# Altium schematic sheet ATWINC3400.SchDoc
size C; SheetNumber: 6; SheetTotal: 9
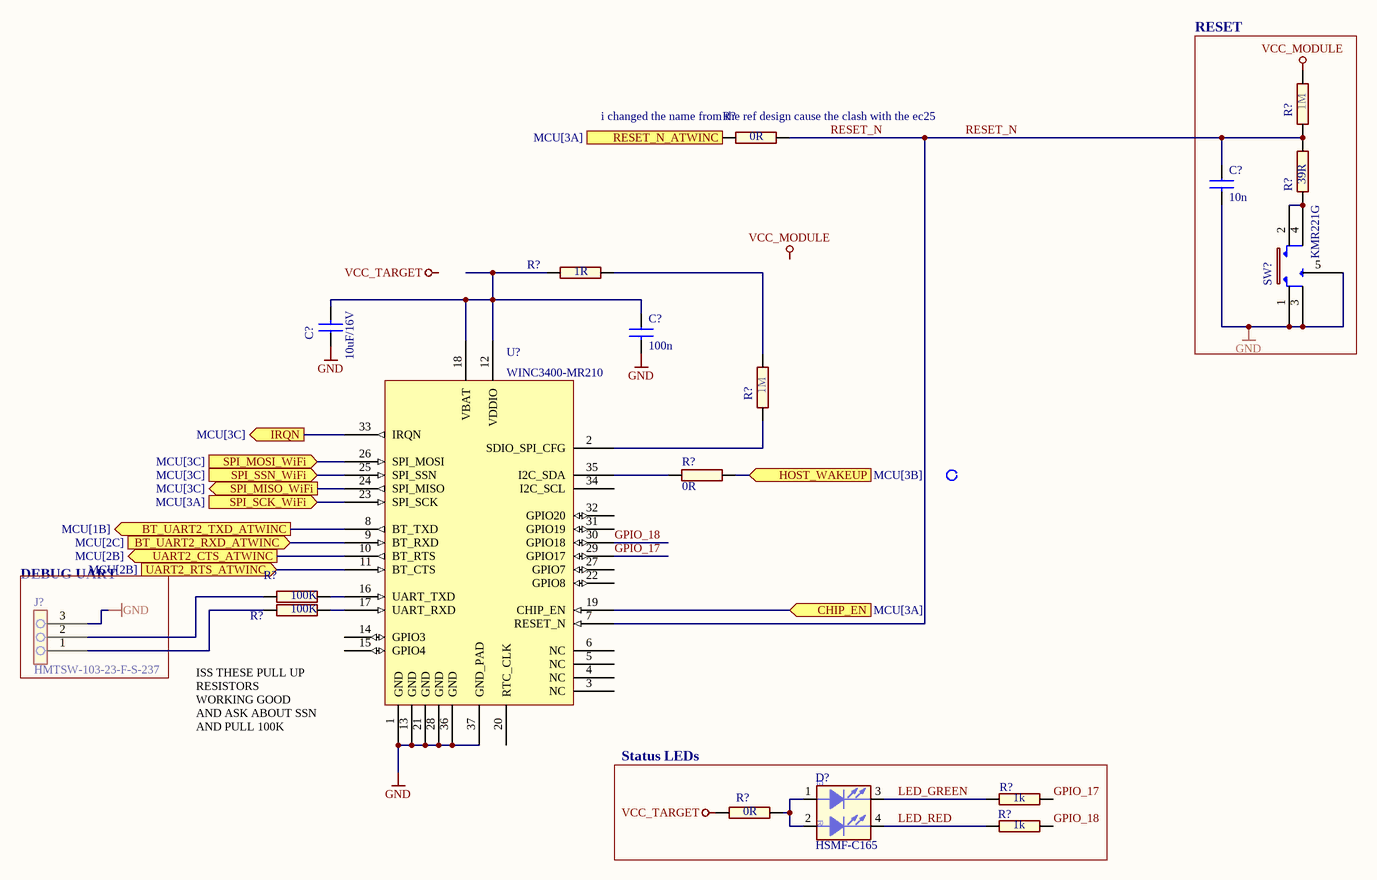
[diagram p0: ATWINC3400.SchDoc]

## Parts
(Parts that share a designator on the sheet are numbered #1, #2 ... from top to bottom, then left to right.)
C?#1  value 10n  [AP1-00001]
C?#2  value 100n  [AP1-00001]
C?#3  value 10uF/16V  [AP1-00039]
D?  value HSMF-C165  [AP4-00132]
J?  value HMTSW-103-23-F-S-237  [AP8-00745]  (hidden comment: Same as A08-1614 but with 1mm hole for optimal reflow soldering (no misalignment of the component))
R?#1  value 0R  [AP2-00011]
R?#2  value 1M  [AP2-00000]
R?#3  value 39R  [AP2-00000]
R?#4  value 1R  [AP2-00011]
R?#5  value 1M  [AP2-00000]
R?#6  value 0R  [AP2-00011]
R?#7  value 100K  [AP2-00011]
R?#8  value 100K  [AP2-00011]
R?#9  value 1k  [AP2-00000]
R?#10  value 0R  [AP2-00011]
R?#11  value 1k  [AP2-00000]
SW?  value KMR221G  [AP8-00274]
U?  value WINC3400-MR210  [AP9-00147]

## Blocks framed on the sheet
RESET: C?#1 R?#2 R?#3 SW?
DEBUG UART: J?
Status LEDs: D? R?#9-R?#11

## Ports
BT_UART2_RXD_ATWINC (in, see MCU[2C]), BT_UART2_TXD_ATWINC (out, see MCU[1B]), CHIP_EN (in, see MCU[3A]), HOST_WAKEUP (in, see MCU[3B]), IRQN (out, see MCU[3C]), RESET_N_ATWINC (in, see MCU[3A]), SPI_MISO_WiFi (out, see MCU[3C]), SPI_MOSI_WiFi (in, see MCU[3C]), SPI_SCK_WiFi (in, see MCU[3A]), SPI_SSN_WiFi (in, see MCU[3C]), UART2_CTS_ATWINC (out, see MCU[2B]), UART2_RTS_ATWINC (in, see MCU[2B])

## Nets
GND: C?#1.2 C?#2.2 C?#3.1 J?.3 SW?.1 SW?.3 SW?.5(GND) U?.1(GND) U?.13(GND) U?.21(GND) U?.28(GND) U?.36(GND) U?.37(GND_PAD)
VCC_MODULE: R?#2.2
VCC_TARGET: R?#10.2
BT_UART2_RXD_ATWINC: U?.9(BT_RXD) ; port BT_UART2_RXD_ATWINC
BT_UART2_TXD_ATWINC: U?.8(BT_TXD) ; port BT_UART2_TXD_ATWINC
CHIP_EN: U?.19(CHIP_EN) ; port CHIP_EN
GPIO_17: R?#9.2 U?.29(GPIO17)
GPIO_18: R?#11.2 U?.30(GPIO18)
HOST_WAKEUP: R?#6.1 ; port HOST_WAKEUP
IRQN: U?.33(IRQN) ; port IRQN
LED_GREEN: D?.3(CATHODE3) R?#9.1
LED_RED: D?.4(CATHODE4) R?#11.1
RESET_N: C?#1.1 R?#1.1 R?#2.1 R?#3.2 U?.7(RESET_N)
RESET_N_ATWINC: R?#1.2 ; port RESET_N_ATWINC
SPI_MISO_WiFi: U?.24(SPI_MISO) ; port SPI_MISO_WiFi
SPI_MOSI_WiFi: U?.26(SPI_MOSI) ; port SPI_MOSI_WiFi
SPI_SCK_WiFi: U?.23(SPI_SCK) ; port SPI_SCK_WiFi
SPI_SSN_WiFi: U?.25(SPI_SSN) ; port SPI_SSN_WiFi
UART2_CTS_ATWINC: U?.10(BT_RTS) ; port UART2_CTS_ATWINC
UART2_RTS_ATWINC: U?.11(BT_CTS) ; port UART2_RTS_ATWINC
NetC?#2_1: C?#2.1 C?#3.2 R?#4.2 U?.12(VDDIO) U?.18(VBAT)
NetD?_1: D?.1(ANODE1) D?.2(ANODE2) R?#10.1
NetJ?_1: J?.1 R?#8.2
NetJ?_2: J?.2 R?#7.2
NetR?#3_1: R?#3.1 SW?.2 SW?.4
NetR?#4_1: R?#4.1 R?#5.2
NetR?#5_1: R?#5.1 U?.2(SDIO_SPI_CFG)
NetR?#6_2: R?#6.2 U?.35(I2C_SDA)
NetR?#7_1: R?#7.1 U?.16(UART_TXD)
NetR?#8_1: R?#8.1 U?.17(UART_RXD)

Not connected (* = marked no-connect by the designer): U? 3(NC) 4(NC) 5(NC) 6(NC) 14(GPIO3) 15(GPIO4) 20(RTC_CLK) 22(GPIO8) 27(GPIO7) 31(GPIO19) 32(GPIO20) 34(I2C_SCL)

## Notes on the sheet
- (near R?#1) i changed the name from the ref design cause the clash with the ec25
- ISS THESE PULL UP RESISTORS WORKING GOOD AND ASK ABOUT SSN AND PULL 100K THAT NEEDED TO BE PUT
- Labels drawn without touching a wire or pin: VCC_MODULE, VCC_TARGET
- (in symbol A10-0154) G; R

## Library data of the parts
C?#1 = A01-0050: Ceramic capacitor, SMD 0402, X7R, 25V, +/-10%; PartGroup: Capacitors,Ceramic,SMD 0402; TemperatureRange: -55 - +125 deg C; ComponentStatus: 'Active (verified)'; Status: Active; Verified by: Lars Helge Mo; Verified date: 2005-12-15; AN: A01-0050; Tolerance: 25V, +/-10%; Height: 0.550000011920929; FootprintStatus: 'Active (Verified)'
C?#2 = A01-0246: Ceramic capacitor, SMD 0402, X7R, 16V, +/-10%; PartGroup: Capacitors,Ceramic,SMD 0402; Manufacturer: Kemet; MPN: C0402C104K4RACTU; TemperatureRange: -55 - +125 deg C; ComponentStatus: 'Active (verified)'; Status: Active; Verified by: Lars Helge Mo; Verified date: 2005-12-15; AN: A01-0246; Tolerance: 16V, +/-10%; Height: 0.5; FootprintStatus: 'Active (Verified)'
C?#3 = A01-0491: Ceramic capacitor, SMD 0603, X5R, 16V, 10UF ± 20% (High Density); PartGroup: Capacitors,Ceramic,SMD 0603; Manufacturer: Taiyo Yuden; MPN: EMK107BBJ106MA-T; ComponentStatus: 'Active (verified)'; TemperatureRange: -55°C to +85°C; Tolerance: ­± 20%; Status: Active; Verified by: Lars Helge Mo; Verified date: 2005-12-15; AN: A01-0491; FootprintStatus: 'Active (Verified)'; Height: 0.819999992847443
D? = A10-0154: LED, Bicolor, Red/Green, Diffused, 1.6x0.8mm; PartGroup: Opto,LEDs,SMD; Manufacturer: Avago Technologies; TemperatureRange: -30Â°C to 85Â°C; ComponentStatus: 'Active (verified)'; AN: A10-0154; Height: 0.5; MPN: HSMF-C165; FootprintStatus: 'Active (Verified)'
J? = A08-1799: 1x3 pin header, 2.54mm pitch, Pin-in-Paste THM, 1mm hole; PartGroup: Mechanical devices,Connectors,Pin headers; Manufacturer: SAMTEC; ComponentStatus: 'Active (verified)'; Verified date: 2006-01-30; Verified by: Lars Helge Mo; Status: Active; AN: A08-1799; Height: 6.09999990463257; MPN: HMTSW-103-23-F-S-237; FootprintStatus: 'Active (Verified)'
R?#1 R?#4 R?#6-R?#8 R?#10 = A02-0163: RES 0.0 OHM 1/16W 0402 SMD; PartGroup: Resistors,SMD,0402 1%; MPN: RMCF0402ZT0R00; Manufacturer: (n/a); Tolerance: 1 %; TemperatureRange: -55 - +125 deg C; ComponentStatus: 'Active (verified)'; Status: Active; Verified by: Lars Helge Mo; Verified date: 2005-12-19; AN: A02-0163; Height: 0.349999994039536; FootprintStatus: 'Active (Verified)'
R?#2 R?#5 = A02-0284: Thick film resistor, SMD 0402, 1/16W, 1%; PartGroup: Resistors,SMD,0402 1%; TemperatureRange: -55 - +125 deg C; ComponentStatus: 'Active (verified)'; Status: Active; Verified by: Lars Helge Mo; Verified date: 2005-12-19; AN: A02-0284; Tolerance: 1 %; Height: 0.349999994039536; FootprintStatus: 'Active (Verified)'
R?#3 = A02-0178: Thick film resistor, SMD 0402, 1/16W, 1%; PartGroup: Resistors,SMD,0402 1%; TemperatureRange: -55 - +125 deg C; ComponentStatus: 'Active (verified)'; Status: Active; Verified by: Lars Helge Mo; Verified date: 2005-12-19; AN: A02-0178; Tolerance: 1 %; Height: 0.349999994039536; FootprintStatus: 'Active (Verified)'
R?#9 R?#11 = A02-0212: Thick film resistor, SMD 0402, 1/16W, 1%; PartGroup: Resistors,SMD,0402 1%; TemperatureRange: -55 - +125 deg C; ComponentStatus: 'Active (verified)'; Status: Active; Verified by: Lars Helge Mo; Verified date: 2005-12-19; AN: A02-0212; Tolerance: 1 %; Height: 0.349999994039536; FootprintStatus: 'Active (Verified)'
SW? = A08-0420: Microminiature Tact Switch for SMT; PartGroup: Mechanical devices,Switches,SMD; Manufacturer: ITT cannon; ComponentStatus: 'Active (verified)'; Status: Active; Verified by: Ketil Skjerve; Verified date: 2006-03-15; AN: A08-0420; Height: 1.89999997615814; MPN: KMR221G; FootprintStatus: 'Active (Verified)'
U? = A06-1356: IEEE 802.11 b/g/n Link Controller with Integrated Low Energy Bluetooth 4.0; PartGroup: Integrated Circuits,Interface ICs,RF; Manufacturer: ATMEL; TemperatureRange: -40Â°C to +85Â°C; ComponentStatus: 'New (not verified)'; AN: A06-1356; MPN: WINC3400-MR210; FootprintStatus: 'Active (Verified)'